# Altium project OZ440-SE140-CAR001.PrjPcb (part 1 of 2)
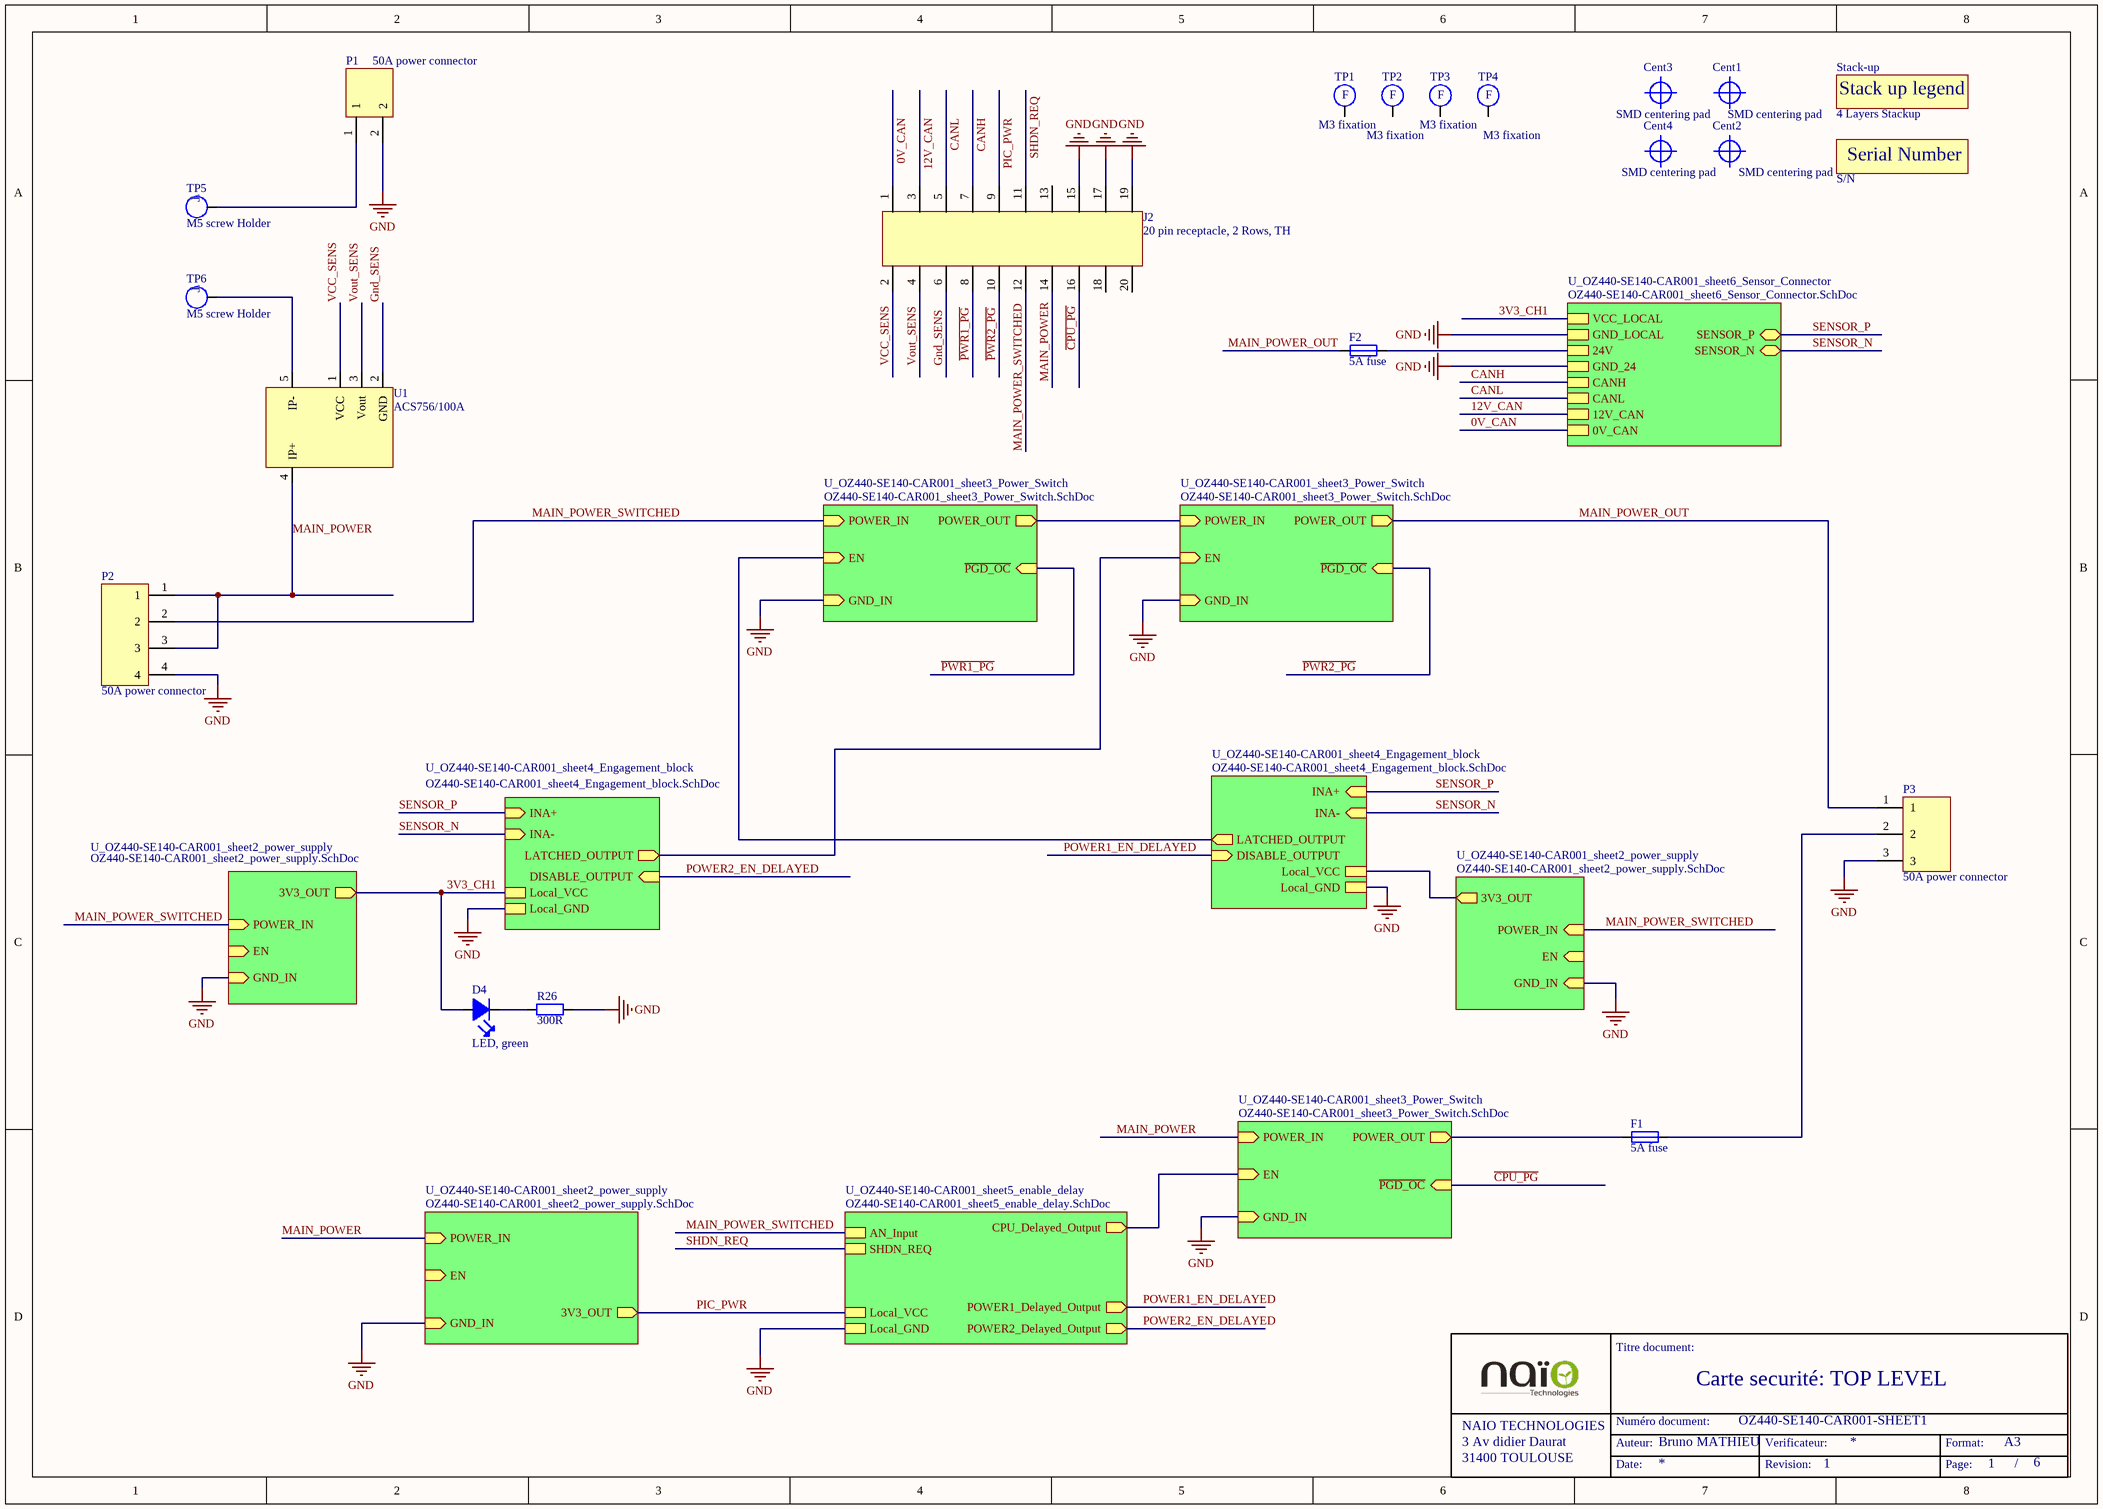
[diagram p0: OZ440-SE140-CAR001_sheet1.SchDoc]
AssyDocumentNumber: OZ440-SE140-ASS001; BoardName: Carte securité barierres sensibles; BoardPartNumber: OZ440-SE140-CAR001; BoardRevision: 2V; DesignEngineer: Bruno MATHIEU; ProjectTitle: OZ440
6 sheets, 153 parts. Net scope: strictly hierarchical (ports join the sheet entries above them; power ports are local).
Board file: OZ440-SE140-CAR001.PcbDoc
Sheets:
  OZ440-SE140-CAR001_sheet1.SchDoc
    U_OZ440-SE140-CAR001_sheet2_power_supply = OZ440-SE140-CAR001_sheet2_power_supply.SchDoc
    U_OZ440-SE140-CAR001_sheet2_power_supply = OZ440-SE140-CAR001_sheet2_power_supply.SchDoc
    U_OZ440-SE140-CAR001_sheet3_Power_Switch = OZ440-SE140-CAR001_sheet3_Power_Switch.SchDoc
    U_OZ440-SE140-CAR001_sheet3_Power_Switch = OZ440-SE140-CAR001_sheet3_Power_Switch.SchDoc
    U_OZ440-SE140-CAR001_sheet4_Engagement_block = OZ440-SE140-CAR001_sheet4_Engagement_block.SchDoc
    U_OZ440-SE140-CAR001_sheet4_Engagement_block = OZ440-SE140-CAR001_sheet4_Engagement_block.SchDoc
    U_OZ440-SE140-CAR001_sheet2_power_supply = OZ440-SE140-CAR001_sheet2_power_supply.SchDoc
    U_OZ440-SE140-CAR001_sheet5_enable_delay = OZ440-SE140-CAR001_sheet5_enable_delay.SchDoc
    U_OZ440-SE140-CAR001_sheet3_Power_Switch = OZ440-SE140-CAR001_sheet3_Power_Switch.SchDoc
    U_OZ440-SE140-CAR001_sheet6_Sensor_Connector = OZ440-SE140-CAR001_sheet6_Sensor_Connector.SchDoc

## Sheet OZ440-SE140-CAR001_sheet1.SchDoc: Carte securité: TOP LEVEL
size A3; Author: Bruno MATHIEU; CompanyName: NAIO TECHNOLOGIES; DrawnBy: Bruno MATHIEU; Engineer: Bruno MATHIEU; DocumentNumber: OZ440-SE140-CAR001-SHEET1; Revision: 1; SheetNumber: 1; SheetTotal: 6; CurrentDate: 27/11/14; DocumentName: Carte securité: TOP LEVEL

### Parts
(Parts that share a designator on the sheet are numbered #1, #2 ... from top to bottom, then left to right.)
Cent1  MEC-STD-CENTER  [MEC-STD-CENTER]  (value not drawn)  (no BOM)
Cent2  MEC-STD-CENTER  [MEC-STD-CENTER]  (value not drawn)  (no BOM)
Cent3  MEC-STD-CENTER  [MEC-STD-CENTER]  (value not drawn)  (no BOM)
Cent4  MEC-STD-CENTER  [MEC-STD-CENTER]  (value not drawn)  (no BOM)
D4  Displayed reference: LED, green  [LED_3MM]  (hidden comment: LED)  (no BOM)
F1#1  Displayed reference: 5A fuse  [F-SPE-154Series_littlefuse]  (hidden comment: FUSE-SMD)
F2  Displayed reference: 5A fuse  [F-SPE-154Series_littlefuse]  (hidden comment: FUSE-SMD)
J2  Displayed reference: 20 pin receptacle, 2 Rows, TH  [CONN-SPE_ESQ-110-12-G-D]  (hidden comment: CONN-STD-20P_2ROW)
P1  Displayed reference: 50A power connector  [CONN-SPE-428192213_MOLEX]  (hidden comment: CONN-STD-2P_puissance)
P2  Displayed reference: 50A power connector  [CONN-SPE-428194213_MOLEX]  (hidden comment: CONN-STD-4P_puissance)
P3  Displayed reference: 50A power connector  [CONN-SPE-428193213_MOLEX]  (hidden comment: CONN-STD-3P_puissance)
R26  Displayed reference: 300R  [R0805-STD]  (hidden comment: RES-SMD)
SN  Displayed reference: S/N  [SERIAL_NUMBER-STD]  (hidden comment: SERIAL-NUMBER)  (no BOM)
Stack-up  Displayed reference: 4 Layers Stackup  [STACKUP-SPE-4LAYERS]  (hidden comment: STACKUP)  (no BOM)
TP1  Displayed reference: M3 fixation  [MEC-STD-FIX_M3]  (hidden comment: FIX-STD-PCB_FIXATION)  (no BOM)
TP2  Displayed reference: M3 fixation  [MEC-STD-FIX_M3]  (hidden comment: FIX-STD-PCB_FIXATION)  (no BOM)
TP3  Displayed reference: M3 fixation  [MEC-STD-FIX_M3]  (hidden comment: FIX-STD-PCB_FIXATION)  (no BOM)
TP4  Displayed reference: M3 fixation  [MEC-STD-FIX_M3]  (hidden comment: FIX-STD-PCB_FIXATION)  (no BOM)
TP5  Displayed reference: M5 screw Holder  [MEC-SPE-WURTHZ_7460408]  (hidden comment: TP-STD-TEST_POINT)
TP6  Displayed reference: M5 screw Holder  [MEC-SPE-WURTHZ_7460408]  (hidden comment: TP-STD-TEST_POINT)
U1  Displayed reference: ACS756/100A  [CA_PFF-SPE-ACS756]  (hidden comment: ACS756-CA_PFF)

### Sub-sheets
U_OZ440-SE140-CAR001_sheet2_power_supply = OZ440-SE140-CAR001_sheet2_power_supply.SchDoc: EN (in), POWER_IN (in), GND_IN (in), 3V3_OUT (out)
U_OZ440-SE140-CAR001_sheet2_power_supply = OZ440-SE140-CAR001_sheet2_power_supply.SchDoc: EN (in), POWER_IN (in), GND_IN (in), 3V3_OUT (out)
U_OZ440-SE140-CAR001_sheet2_power_supply = OZ440-SE140-CAR001_sheet2_power_supply.SchDoc: EN (in), POWER_IN (in), GND_IN (in), 3V3_OUT (out)
U_OZ440-SE140-CAR001_sheet3_Power_Switch = OZ440-SE140-CAR001_sheet3_Power_Switch.SchDoc: POWER_IN (in), GND_IN (in), EN (in), POWER_OUT (out), ~{PGD_OC} (in)
U_OZ440-SE140-CAR001_sheet3_Power_Switch = OZ440-SE140-CAR001_sheet3_Power_Switch.SchDoc: POWER_IN (in), GND_IN (in), EN (in), POWER_OUT (out), ~{PGD_OC} (in)
U_OZ440-SE140-CAR001_sheet3_Power_Switch = OZ440-SE140-CAR001_sheet3_Power_Switch.SchDoc: POWER_IN (in), GND_IN (in), EN (in), POWER_OUT (out), ~{PGD_OC} (in)
U_OZ440-SE140-CAR001_sheet4_Engagement_block = OZ440-SE140-CAR001_sheet4_Engagement_block.SchDoc: LATCHED_OUTPUT (out), Local_VCC, Local_GND, INA+ (in), INA- (in), DISABLE_OUTPUT (in)
U_OZ440-SE140-CAR001_sheet4_Engagement_block = OZ440-SE140-CAR001_sheet4_Engagement_block.SchDoc: LATCHED_OUTPUT (out), Local_VCC, Local_GND, INA+ (in), INA- (in), DISABLE_OUTPUT (in)
U_OZ440-SE140-CAR001_sheet5_enable_delay = OZ440-SE140-CAR001_sheet5_enable_delay.SchDoc: Local_VCC, Local_GND, AN_Input, CPU_Delayed_Output (out), SHDN_REQ, POWER1_Delayed_Output (out), POWER2_Delayed_Output (out)
U_OZ440-SE140-CAR001_sheet6_Sensor_Connector = OZ440-SE140-CAR001_sheet6_Sensor_Connector.SchDoc: VCC_LOCAL, GND_LOCAL, 24V, GND_24, CANH, CANL, 12V_CAN, 0V_CAN, SENSOR_P, SENSOR_N

### Nets
3V3_CH1: D4.1(A) ; sheet U_OZ440-SE140-CAR001_sheet4_Engagement_block/Local_VCC, sheet U_OZ440-SE140-CAR001_sheet2_power_supply/3V3_OUT, sheet U_OZ440-SE140-CAR001_sheet6_Sensor_Connector/VCC_LOCAL
GND: J2.15 J2.17 J2.19 P1.2 P2.4 P3.3 R26.1 ; sheet U_OZ440-SE140-CAR001_sheet2_power_supply/GND_IN, sheet U_OZ440-SE140-CAR001_sheet2_power_supply/GND_IN, sheet U_OZ440-SE140-CAR001_sheet3_Power_Switch/GND_IN, sheet U_OZ440-SE140-CAR001_sheet3_Power_Switch/GND_IN, sheet U_OZ440-SE140-CAR001_sheet4_Engagement_block/Local_GND, sheet U_OZ440-SE140-CAR001_sheet4_Engagement_block/Local_GND, sheet U_OZ440-SE140-CAR001_sheet2_power_supply/GND_IN, sheet U_OZ440-SE140-CAR001_sheet5_enable_delay/Local_GND, sheet U_OZ440-SE140-CAR001_sheet3_Power_Switch/GND_IN, sheet U_OZ440-SE140-CAR001_sheet6_Sensor_Connector/GND_LOCAL, sheet U_OZ440-SE140-CAR001_sheet6_Sensor_Connector/GND_24
PIC_PWR: J2.9 ; sheet U_OZ440-SE140-CAR001_sheet2_power_supply/3V3_OUT, sheet U_OZ440-SE140-CAR001_sheet5_enable_delay/Local_VCC
VCC: sheet U_OZ440-SE140-CAR001_sheet2_power_supply/3V3_OUT, sheet U_OZ440-SE140-CAR001_sheet4_Engagement_block/Local_VCC
0V_CAN: J2.1 ; sheet U_OZ440-SE140-CAR001_sheet6_Sensor_Connector/0V_CAN
12V_CAN: J2.3 ; sheet U_OZ440-SE140-CAR001_sheet6_Sensor_Connector/12V_CAN
~{CPU_PG}: J2.16 ; sheet U_OZ440-SE140-CAR001_sheet3_Power_Switch/~{PGD_OC}
~{PWR1_PG}: J2.8 ; sheet U_OZ440-SE140-CAR001_sheet3_Power_Switch/~{PGD_OC}
~{PWR2_PG}: J2.10 ; sheet U_OZ440-SE140-CAR001_sheet3_Power_Switch/~{PGD_OC}
CANH: J2.7 ; sheet U_OZ440-SE140-CAR001_sheet6_Sensor_Connector/CANH
CANL: J2.5 ; sheet U_OZ440-SE140-CAR001_sheet6_Sensor_Connector/CANL
Gnd_SENS: J2.6 U1.2(GND)
MAIN_POWER: J2.14 P2.1 P2.3 U1.4(IP+) ; sheet U_OZ440-SE140-CAR001_sheet2_power_supply/POWER_IN, sheet U_OZ440-SE140-CAR001_sheet3_Power_Switch/POWER_IN
MAIN_POWER_OUT: F2.1 P3.1 ; sheet U_OZ440-SE140-CAR001_sheet3_Power_Switch/POWER_OUT
MAIN_POWER_SWITCHED: J2.12 P2.2 ; sheet U_OZ440-SE140-CAR001_sheet2_power_supply/POWER_IN, sheet U_OZ440-SE140-CAR001_sheet3_Power_Switch/POWER_IN, sheet U_OZ440-SE140-CAR001_sheet2_power_supply/POWER_IN, sheet U_OZ440-SE140-CAR001_sheet5_enable_delay/AN_Input
POWER1_EN_DELAYED: sheet U_OZ440-SE140-CAR001_sheet4_Engagement_block/DISABLE_OUTPUT, sheet U_OZ440-SE140-CAR001_sheet5_enable_delay/POWER1_Delayed_Output
POWER2_EN_DELAYED: sheet U_OZ440-SE140-CAR001_sheet4_Engagement_block/DISABLE_OUTPUT, sheet U_OZ440-SE140-CAR001_sheet5_enable_delay/POWER2_Delayed_Output
SENSOR_N: sheet U_OZ440-SE140-CAR001_sheet4_Engagement_block/INA-, sheet U_OZ440-SE140-CAR001_sheet4_Engagement_block/INA-, sheet U_OZ440-SE140-CAR001_sheet6_Sensor_Connector/SENSOR_N
SENSOR_P: sheet U_OZ440-SE140-CAR001_sheet4_Engagement_block/INA+, sheet U_OZ440-SE140-CAR001_sheet4_Engagement_block/INA+, sheet U_OZ440-SE140-CAR001_sheet6_Sensor_Connector/SENSOR_P
SHDN_REQ: J2.11 ; sheet U_OZ440-SE140-CAR001_sheet5_enable_delay/SHDN_REQ  [project net ~{Rese}t_PIC]
VCC_SENS: J2.2 U1.1(VCC)
Vout_SENS: J2.4 U1.3(Vout)
NetC7_U_OZ440-SE140-CAR001_sheet3_Power_Switch#2_2: sheet U_OZ440-SE140-CAR001_sheet3_Power_Switch/POWER_OUT, sheet U_OZ440-SE140-CAR001_sheet3_Power_Switch/POWER_IN
NetC8_U_OZ440-SE140-CAR001_sheet3_Power_Switch#3_1: F1#1.1 ; sheet U_OZ440-SE140-CAR001_sheet3_Power_Switch/POWER_OUT
NetD4_2: D4.2 R26.2
NetF1#1_2: F1#1.2 P3.2
NetF2_2: F2.2 ; sheet U_OZ440-SE140-CAR001_sheet6_Sensor_Connector/24V
NetP1_1: P1.1 TP5.1(T)
NetQ2_U_OZ440-SE140-CAR001_sheet4_Engagement_block#1_3: sheet U_OZ440-SE140-CAR001_sheet3_Power_Switch/EN, sheet U_OZ440-SE140-CAR001_sheet4_Engagement_block/LATCHED_OUTPUT
NetQ2_U_OZ440-SE140-CAR001_sheet4_Engagement_block#2_3: sheet U_OZ440-SE140-CAR001_sheet3_Power_Switch/EN, sheet U_OZ440-SE140-CAR001_sheet4_Engagement_block/LATCHED_OUTPUT
NetTP6_1: TP6.1(T) U1.5(IP-)
NetU3_U_OZ440-SE140-CAR001_sheet3_Power_Switch#3_5: sheet U_OZ440-SE140-CAR001_sheet5_enable_delay/CPU_Delayed_Output, sheet U_OZ440-SE140-CAR001_sheet3_Power_Switch/EN

Not connected (* = marked no-connect by the designer): J2 13 18 20; TP1 1(T); TP2 1(T); TP3 1(T); TP4 1(T)

### Notes on the sheet
- Titre document:
- NAIO TECHNOLOGIES
- 3 Av didier Daurat
- 31400 TOULOUSE
- Auteur:
- Numéro document:
- Verificateur:
- Format:
- A3
- Date:
- Revision:
- Page:
- /
- (in symbol 4 Layers Stackup) Stack up legend
- (in symbol M3 Fixation) F

### Library data of the parts
Cent1-Cent4 = SMD centering pad: Validated: False; Reference: SMD centering pad; Displayed reference: SMD centering pad
D4 = L-934GD: LED 3mm green TH; Manufacturer: Kingbright; Max Current: 20mA; Validated: False; Reference: L-934GD; Footprint description: TH 2.54mm pitch; Pin Count: 2; Rev: V.8; helpURL: http://www.farnell.com/datasheets/67148.pdf; Supplier 1: Farnell; Supplier Part Number 1: 1142502
F1#1 F2 = 0154005.DRT: 5A T fuse with SMD holder; Manufacturer: LITTLEFUSE; Max Voltage: 125V; Validated: False; Reference: 0154005.DRT; Max Current: 5A; Pin Count: 2; Rev: 3/10/14; helpURL: http://www.farnell.com/datasheets/1840330.pdf; Supplier 1: Farnell; Supplier Part Number 1: 2452874; Supplier 2: Mouser; Supplier Part Number 2: 576-0154005.DRTL
J2 = ESQ-110-12-G-D: 20 pin receptacle, 2.54mm, TH; Manufacturer: SAMTEC; Validated: False; Reference: ESQ-110-12-G-D; Footprint description: 20 pin receptacle, TH; Pin Count: 20; helpURL: https://www.samtec.com/technical-specifications/Default.aspx?SeriesMaster=ESQ; Supplier 1: Farnell; Supplier Part Number 1: 1769167
P1 = 42819-2213: 2 pin power connector, ST; Manufacturer: Molex; Max Voltage: 600V; Max Current: 50A; Validated: False; Reference: 42819-2213; Footprint description: Thu hole 10mm pitch; Pin Count: 2; Rev: E6; helpURL: http://www.molex.com/pdm_docs/sd/428192213_sd.pdf; Supplier 1: Newark; Supplier Part Number 1: 61H8951; Supplier 2: Mouser; Supplier Part Number 2: 538-42819-2213
P2 = 42819-4213: 4 pin power connector; Manufacturer: Molex; Max Voltage: 600V; Max Current: 50A; Validated: False; Reference: 42819-4213; Footprint description: Thu hole 10mm pitch; Pin Count: 4; Rev: E6; helpURL: http://www.molex.com/pdm_docs/sd/428194213_sd.pdf; Supplier 1: Mouser; Supplier Part Number 1: 538-42819-4213; Supplier 2: Newark; Supplier Part Number 2: 92M0969
P3 = 42819-3213: 3 pin power connector, ST; Manufacturer: Molex; Max Voltage: 600V; Max Current: 50A; Validated: False; Reference: 42819-3213; Footprint description: Thu hole 10mm pitch; Pin Count: 3; Rev: E6; helpURL: http://www.molex.com/pdm_docs/sd/428193213_sd.pdf; Supplier 1: Mouser; Supplier Part Number 1: 538-42819-3213; Supplier 2: Farnell; Supplier Part Number 2: 2334074
R26 = CRCW0805300RFKxx: 300 ohm 0805 SMD resistor; Manufacturer: Vishay; Value: 300; Tolerance: 1%; Rated Power: 0.125W; Validated: No; Reference: CRCW0805300RFKxx; Footprint description: standard 0805 SMD; Pin Count: 2; helpURL: http://www.vishay.com/docs/20035/dcrcwe3.pdf; Supplier 1: Mouser; Supplier Part Number 1: 71-CRCW0805300RFKEA; Supplier 2: Farnell; Supplier Part Number 2: 1152346
SN = Serial Number: serial number copper identification; Validated: False; Reference: Serial Number
Stack-up = 4 Layers Stackup: 4 Layers Stackup identification; Validated: False; Reference: 4 Layers Stackup
TP1-TP4 = M3 Fixation: M3 Hole for Board fixation; Validated: False; Reference: M3 Fixation
TP5 TP6 = 7460408: Bush with threaded hole M5; Manufacturer: WURTHZ; Max Current: 160A; Validated: False; Reference: 7460408; Material: CuZn39Pb3; Footprint description: Pressfit Bush with threaded hole M5; Pin Count: 1; helpURL: http://katalog.we-online.de/em/datasheet/7460408.pdf; Supplier 1: Farnell; Supplier Part Number 1: 1821279; Supplier 2: Mouser; Supplier Part Number 2: 710-7460408
U1 = ACS756SCA-100B-PFF-T: +/- 100A Linear Current Sensor IC; Manufacturer: Allegro; Max Voltage: 5; Frequency band: 100kHz; Gain: 40mV/A; Validated: False; Reference: ACS756SCA-100B-PFF-T; Max Current: 100A; Footprint description: CA_PFF specific; Pin Count: 5; Rev: 6; helpURL: http://www.allegromicro.com/~/media/Files/Datasheets/ACS756-Datasheet.ashx; Supplier 1: Farnell; Supplier Part Number 1: 2112638; Supplier 2: Digi-Key; Supplier Part Number 2: 620-1238-ND

## Sheet OZ440-SE140-CAR001_sheet2_power_supply.SchDoc
size A3
Used 3 times, as channels U_OZ440-SE140-CAR001_sheet2_power_supply, U_OZ440-SE140-CAR001_sheet2_power_supply, U_OZ440-SE140-CAR001_sheet2_power_supply. Parts and nets are listed once, with the designators drawn on the sheet.
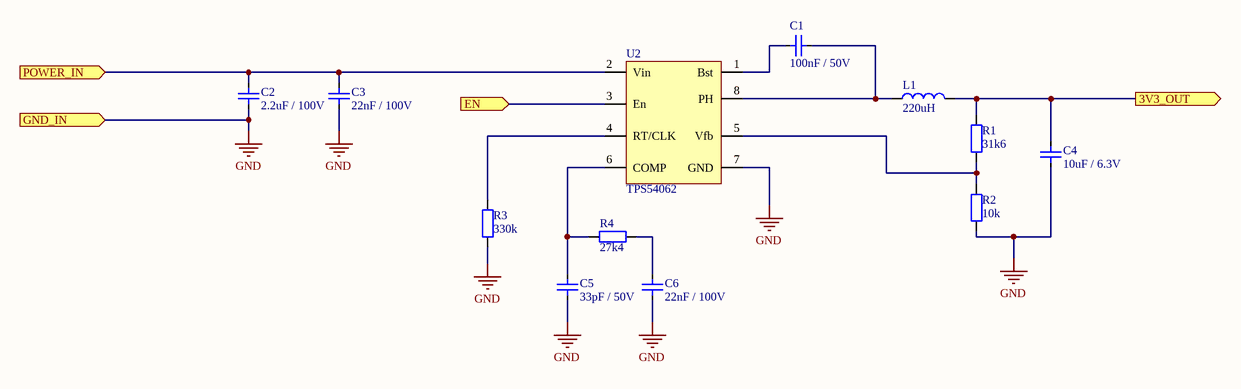
[diagram p1: OZ440-SE140-CAR001_sheet2_power_supply.SchDoc]

### Parts
C1  Displayed reference: 100nF / 50V  [C0805-STD]  (hidden comment: CAP-SMD)
C2  Displayed reference: 2.2uF / 100V  [C1206-STD]  (hidden comment: CAP-SMD)
C3  Displayed reference: 22nF / 100V  [C0805-STD]  (hidden comment: CAP-SMD)
C4  Displayed reference: 10uF / 6.3V  [C0805-STD]  (hidden comment: CAP-SMD)
C5  Displayed reference: 33pF / 50V  [C0805-STD]  (hidden comment: CAP-SMD)
C6  Displayed reference: 22nF / 100V  [C0805-STD]  (hidden comment: CAP-SMD)
L1  Displayed reference: 220uH  [L-SPE-4600Series_Murata]  (hidden comment: IND-SMD)
R1  Displayed reference: 31k6  [R0805-STD]  (hidden comment: RES-SMD)
R2  Displayed reference: 10k  [R0805-STD]  (hidden comment: RES-SMD)
R3  Displayed reference: 330k  [R0805-STD]  (hidden comment: RES-SMD)
R4  Displayed reference: 27k4  [R0805-STD]  (hidden comment: RES-SMD)
U2  Displayed reference: TPS54062  [MSOP08-SPE-TPS54062]  (hidden comment: TPS54062-MSOP8)

### Ports
3V3_OUT (out), EN (in), GND_IN (in), POWER_IN (in)

### Nets
GND: C2.1 C3.1 C4.1 C5.1 C6.1 R2.1 R3.1 U2.7(GND) ; port GND_IN
3V3_OUT: C4.2 L1.2 R1.2 ; port 3V3_OUT
EN: U2.3(En) ; port EN
POWER_IN: C2.2 C3.2 U2.2(Vin) ; port POWER_IN
NetC1_1: C1.1 U2.1(Bst)
NetC1_2: C1.2 L1.1 U2.8(PH)
NetC5_2: C5.2 R4.1 U2.6(COMP)
NetC6_2: C6.2 R4.2
NetR1_1: R1.1 R2.2 U2.5(Vfb)
NetR3_2: R3.2 U2.4(RT/CLK)

### Channels
U_OZ440-SE140-CAR001_sheet2_power_supply: designators end in _U_OZ440-SE140-CAR001_sheet2_power_supply#1; ports 3V3_OUT=PIC_PWR EN=NetU2_U_OZ440-SE140-CAR001_sheet2_power_supply#1_3 GND_IN=GND POWER_IN=MAIN_POWER
U_OZ440-SE140-CAR001_sheet2_power_supply: designators end in _U_OZ440-SE140-CAR001_sheet2_power_supply#2; ports 3V3_OUT=VCC EN=NetU2_U_OZ440-SE140-CAR001_sheet2_power_supply#2_3 GND_IN=GND POWER_IN=MAIN_POWER_SWITCHED
U_OZ440-SE140-CAR001_sheet2_power_supply: designators end in _U_OZ440-SE140-CAR001_sheet2_power_supply#3; ports 3V3_OUT=3V3_CH1 EN=NetU2_U_OZ440-SE140-CAR001_sheet2_power_supply#3_3 GND_IN=GND POWER_IN=MAIN_POWER_SWITCHED

### Notes on the sheet
- Titre document:
- NAIO TECHNOLOGIES
- 3 Av didier Daurat
- 31400 TOULOUSE
- Auteur:
- Numéro document:
- Verificateur:
- Format:
- A3
- Date:
- Revision:
- Page:
- /

### Library data of the parts
C1 = VJ0805Y104KXAxx: 0805 100nF / 50V  X7R ceramic capacitor; Manufacturer: vishay; Max Voltage: 50; Tolerance: +/- 10%; Validated: N; Reference: VJ0805Y104KXAxx; Value: 100nF; Material: X7R; Footprint description: standard Capacitor 0805; Pin Count: 2; helpURL: http://www.vishay.com/docs/45200/highrels.pdf; Supplier 1: Farnell; Supplier Part Number 1: 1612208; Supplier 2: Digi-Key; Supplier Part Number 2: 720-1266-6-ND
C2 = C3216X7S2A225Kxxx: 1206 2.2uF / 100V X7S ceramic capacitor; Manufacturer: TDK; Max Voltage: 100; Tolerance: +/- 10%; Validated: N; Reference: C3216X7S2A225Kxxx; Value: 2.2uF; Material: X7S; Footprint description: standard Capacitor 1206; Pin Count: 2; helpURL: http://www.mouser.com/ds/2/400/C3216X7S2A225K160AB-265429.pdf; Supplier 1: Mouser; Supplier Part Number 1: 810-C3216X7S2A225K; Supplier 2: Farnell; Supplier Part Number 2: 2112717
C3 C6 = VJ0805Y223KXBxx: 0805 22nF / 100V X7R ceramic capacitor; Manufacturer: vishay; Value: 100nF; Max Voltage: 100; Tolerance: +/- 10%; Validated: N; Reference: VJ0805Y223KXBxx; Material: X7R; Footprint description: standard Capacitor 0805; Pin Count: 2; helpURL: http://www.vishay.com/docs/45200/highrels.pdf; Supplier 1: Mouser; Supplier Part Number 1: 77-VJ0805Y223KXBBC31; Supplier 2: Farnell; Supplier Part Number 2: 2407374
C4 = C0805C106K9PACxx: 0805 10uF / 6.3V X5R ceramic capacitor; Manufacturer: Kemet; Max Voltage: 6.3; Tolerance: +/- 10%; Validated: N; Reference: C0805C106K9PACxx; Value: 10uF; Material: X5R; Footprint description: standard Capacitor 0805; Pin Count: 2; helpURL: http://www.farnell.com/datasheets/40863.pdf; Supplier 1: Farnell; Supplier Part Number 1: 1643357; Supplier 2: Digi-Key; Supplier Part Number 2: 399-3138-1-ND
C5 = C0805C330J5GACxx: 0805 33pF / 50V COG ceramic capacitor; Manufacturer: Kemet; Max Voltage: 50; Tolerance: +/- 10%; Validated: False; Reference: C0805C330J5GACxx; Value: 33pF; Material: COG; Footprint description: standard Capacitor 0805; Pin Count: 2; helpURL: http://www.farnell.com/datasheets/40863.pdf; Supplier 1: Mouser; Supplier Part Number 1: 80-C0805C330J5GACTM; Supplier 2: Farnell; Supplier Part Number 2: 1414685
L1 = 46224C: 220uH SMD inductor; Manufacturer: MURATA; Reference: 46224C; Max Current: 0.57A; Validated: False; Value: 220uH; Footprint description: SMD 2 pin; Pin Count: 2; Rev: B03; helpURL: http://www.farnell.com/datasheets/1482257.pdf; Supplier 1: Mouser; Supplier Part Number 1: 580-46224C; Supplier 2: Farnell; Supplier Part Number 2: 2062837
R1 = CRCW080531K6FKxx: 31k6 Ohm 0805 SMD resistor; Manufacturer: Vishay; Value: 31 600; Tolerance: 1%; Rated Power: 0.125W; Validated: False; Reference: CRCW080531K6FKxx; Footprint description: standard 0805 SMD; Pin Count: 2; helpURL: http://www.vishay.com/docs/20035/dcrcwe3.pdf; Supplier 1: Mouser; Supplier Part Number 1: 71-CRCW0805-31.6K-E3; Supplier 2: Farnell; Supplier Part Number 2: 1469916
R2 = CRCW080510K0FKxx: 10k Ohm 0805 SMD resistor; Manufacturer: Vishay; Value: 10 000; Tolerance: 1 %; Rated Power: 0,125 W; Validated: No; Reference: CRCW080510K0FKxx; Footprint description: standard 0805 SMD; Pin Count: 2; helpURL: http://www.vishay.com/docs/20035/dcrcwe3.pdf; Supplier 1: Farnell; Supplier Part Number 1: 1469856; Supplier 2: Mouser; Supplier Part Number 2: 71-CRCW0805-10K-E3
R3 = CRCW0805330KFKxx: 330k Ohm 0805 SMD resistor; Manufacturer: Vishay; Value: 330 000; Tolerance: 1%; Rated Power: 0.125W; Validated: False; Reference: CRCW0805330KFKxx; Footprint description: standard 0805 SMD; Pin Count: 2; helpURL: http://www.vishay.com/docs/20035/dcrcwe3.pdf; Supplier 1: Farnell; Supplier Part Number 1: 2123444; Supplier 2: Mouser; Supplier Part Number 2: 71-CRCW0805330KFKEA
R4 = CRCW080527K4FKxx: 27k4 Ohm 0805 SMD resistor; Manufacturer: Vishay; Value: 27 400; Tolerance: 1%; Rated Power: 0.125W; Validated: False; Reference: CRCW080527K4FKxx; Footprint description: standard 0805 SMD; Pin Count: 2; helpURL: http://www.vishay.com/docs/20035/dcrcwe3.pdf; Supplier 1: Mouser; Supplier Part Number 1: 71-CRCW0805-27.4K-E3; Supplier 2: Farnell; Supplier Part Number 2: 1652971RL
U2 = TPS54062DGK: 4.7V to 60V Input, 50mA Synchronous Step-Down Converter; Manufacturer: TI; Max Current: 0.05A; Validated: False; Reference: TPS54062DGK; Max Voltage: 60V; Footprint description: MSOP-8; Pin Count: 8; Rev: 05/2011; helpURL: http://www.ti.com/lit/ds/symlink/tps54062.pdf; Supplier 1: Farnell; Supplier Part Number 1: 2045284; Supplier 2: Mouser; Supplier Part Number 2: 595-TPS54062DGKR

## Sheet OZ440-SE140-CAR001_sheet3_Power_Switch.SchDoc
size A3
Used 3 times, as channels U_OZ440-SE140-CAR001_sheet3_Power_Switch, U_OZ440-SE140-CAR001_sheet3_Power_Switch, U_OZ440-SE140-CAR001_sheet3_Power_Switch. Parts and nets are listed once, with the designators drawn on the sheet.
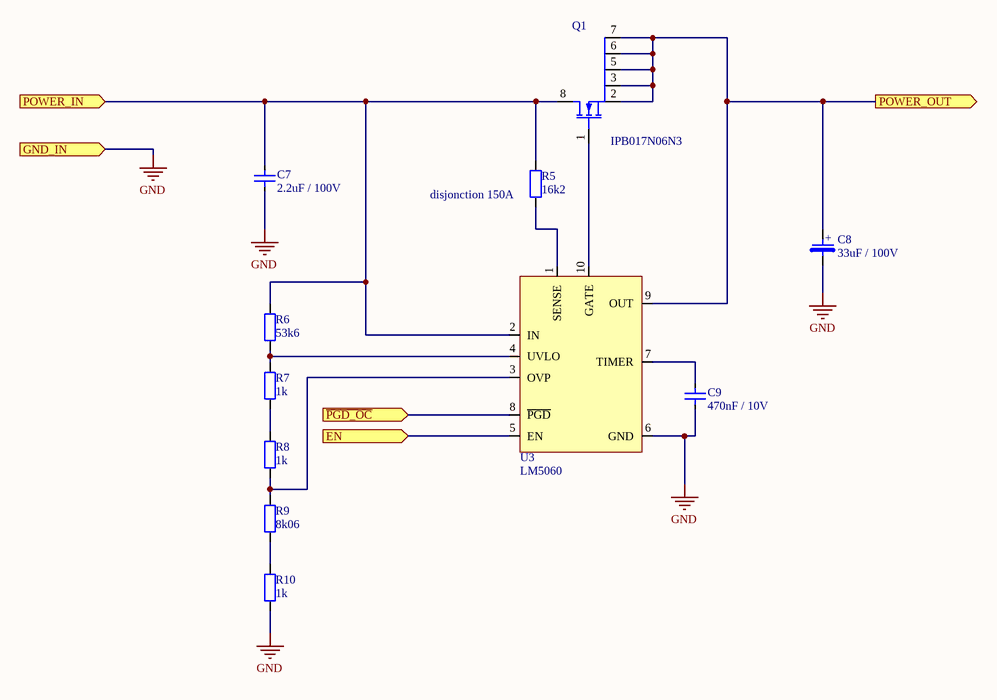
[diagram p2: OZ440-SE140-CAR001_sheet3_Power_Switch.SchDoc]

### Parts
C7  Displayed reference: 2.2uF / 100V  [C1206-STD]  (hidden comment: CAP-SMD)
C8  Displayed reference: 33uF / 100V  [CAP-ELECTRO-SMD_SIZE_G]  (hidden comment: CAP-POL-SMD)
C9  Displayed reference: 470nF / 10V  [C0603-STD]  (hidden comment: CAP-SMD)
Q1  Displayed reference: IPB017N06N3  [TO263-3-SPE-IPB039N10N3]  (hidden comment: IPB039N10N3-PGTO263_3)
R5  Displayed reference: 16k2  [R0805-STD]  (hidden comment: RES-SMD)
R6  Displayed reference: 53k6  [R0805-STD]  (hidden comment: RES-SMD)
R7  Displayed reference: 1k  [R0805-STD]  (hidden comment: RES-SMD)
R8  Displayed reference: 1k  [R0805-STD]  (hidden comment: RES-SMD)
R9  Displayed reference: 8k06  [R0805-STD]  (hidden comment: RES-SMD)
R10  Displayed reference: 1k  [R0805-STD]  (hidden comment: RES-SMD)
U3  Displayed reference: LM5060  [VSSOP10-SPE-LM5060]  (hidden comment: LM5060-VSSOP10)

### Ports
EN (in), GND_IN (in), POWER_IN (in), POWER_OUT (out), ~{PGD_OC} (in)

### Nets
GND: C7.1 C8.2 C9.1 R10.1 U3.6(GND) ; port GND_IN
~{PGD_OC}: U3.8(~{PGD}) ; port ~{PGD_OC}
EN: U3.5(EN) ; port EN
POWER_IN: C7.2 Q1.8(S) R5.2 R6.2 U3.2(IN) ; port POWER_IN
POWER_OUT: C8.1 Q1.2(D) Q1.3(D) Q1.5(D) Q1.6(D) Q1.7(D) U3.9(OUT) ; port POWER_OUT
NetC9_2: C9.2 U3.7(TIMER)
NetQ1_1: Q1.1(G) U3.10(GATE)
NetR5_1: R5.1 U3.1(SENSE)
NetR6_1: R6.1 R7.2 U3.4(UVLO)
NetR7_1: R7.1 R8.2
NetR8_1: R8.1 R9.2 U3.3(OVP)
NetR9_1: R9.1 R10.2

### Channels
U_OZ440-SE140-CAR001_sheet3_Power_Switch: designators end in _U_OZ440-SE140-CAR001_sheet3_Power_Switch#1; ports EN=NetQ2_U_OZ440-SE140-CAR001_sheet4_Engagement_block#2_3 GND_IN=GND POWER_IN=MAIN_POWER_SWITCHED POWER_OUT=NetC7_U_OZ440-SE140-CAR001_sheet3_Power_Switch#2_2 ~{PGD_OC}=~{PWR1_PG}
U_OZ440-SE140-CAR001_sheet3_Power_Switch: designators end in _U_OZ440-SE140-CAR001_sheet3_Power_Switch#2; ports EN=NetQ2_U_OZ440-SE140-CAR001_sheet4_Engagement_block#1_3 GND_IN=GND POWER_IN=NetC7_U_OZ440-SE140-CAR001_sheet3_Power_Switch#2_2 POWER_OUT=MAIN_POWER_OUT ~{PGD_OC}=~{PWR2_PG}
U_OZ440-SE140-CAR001_sheet3_Power_Switch: designators end in _U_OZ440-SE140-CAR001_sheet3_Power_Switch#3; ports EN=NetU3_U_OZ440-SE140-CAR001_sheet3_Power_Switch#3_5 GND_IN=GND POWER_IN=MAIN_POWER POWER_OUT=NetC8_U_OZ440-SE140-CAR001_sheet3_Power_Switch#3_1 ~{PGD_OC}=~{CPU_PG}

### Notes on the sheet
- (near R5) disjonction 150A
- Titre document:
- NAIO TECHNOLOGIES
- 3 Av didier Daurat
- 31400 TOULOUSE
- Auteur:
- Numéro document:
- Verificateur:
- Format:
- A3
- Date:
- Revision:
- Page:
- /
- (in symbol EEE2AA330P) +

### Library data of the parts
C7 = C3216X7S2A225Kxxx: as C2 on sheet OZ440-SE140-CAR001_sheet2_power_supply; Reference: C3216X7S2A225Kxxx; Value: 2.2uF; Material: X7S; Footprint description: standard Capacitor 1206; Pin Count: 2; helpURL: http://www.mouser.com/ds/2/400/C3216X7S2A225K160AB-265429.pdf; Supplier 1: Mouser; Supplier Part Number 1: 810-C3216X7S2A225K; Supplier 2: Farnell; Supplier Part Number 2: 2112717
C8 = EEE2AA330P: 33uF / 100V Aluminium capacitor SMD; Manufacturer: Panasonic; Max Current: 0.05; Reference: EEE2AA330P; Value: 33uF; Max Voltage: 100V; Material: Aluminium; Footprint description: 10mmx10mm; Pin Count: 2; helpURL: http://industrial.panasonic.com/www-data/pdf/ABA0000/ABA0000CE2.pdf; Supplier 1: Farnell; Supplier Part Number 1: 1899628; Supplier 2: Mouser; Supplier Part Number 2: 667-EEE-2AA330P
C9 = 0603ZD474KAT2A: 0603 470nF / 10V X5R ceramic capacitor; Manufacturer: AVX; Max Voltage: 10; Tolerance: +/- 10%; Validated: N; Reference: 0603ZD474KAT2A; Value: 470nF; Material: X5R; Footprint description: standard Capacitor 0603; Pin Count: 2; helpURL: http://avx.com/docs/Catalogs/cx7r.pdf; Supplier 1: Farnell; Supplier Part Number 1: 1833805; Supplier 2: Mouser; Supplier Part Number 2: 581-0603ZD474KAT2A
Q1 = IPB017N06N3: 60V/180A N channel MOSFET in DPAK package; Manufacturer: INFINEON; Max Voltage: 60V; Max Current: 180A; Rated Power: 250W; Reference: IPB017N06N3; component type: NMOS; Footprint description: DPAK 8 pin; Pin Count: 8; Rev: 2.2; helpURL: https://www.infineon.com/dgdl/IPB017N06N3_Rev2.2.pdf?folderId=db3a30431441fb5d01148ca9f1be0e77&fileId=db3a30431ddc9372011e264a7ab746ea; Supplier 1: Farnell; Supplier Part Number 1: 1775519; Supplier 2: Mouser; Supplier Part Number 2: 726-IPB017N06N3G
R5 = CRCW080516K2FKxx: 16k2 Ohm 0805 SMD resistor; Manufacturer: Vishay; Value: 16200; Tolerance: 1%; Rated Power: 0.125W; Validated: No; Reference: CRCW080516K2FKxx; Footprint description: standard 0805 SMD; Pin Count: 2; helpURL: http://www.vishay.com/docs/20035/dcrcwe3.pdf; Supplier 1: Mouser; Supplier Part Number 1: 71-CRCW0805-16.2K-E3; Supplier 2: Farnell; Supplier Part Number 2: 1469878
R6 = CRCW080553K6FKxx: 53k6 Ohm 0805 SMD resistor; Manufacturer: Vishay; Value: 53600; Tolerance: 1%; Rated Power: 0.125W; Validated: No; Reference: CRCW080553K6FKxx; Footprint description: standard 0805 SMD; Pin Count: 2; helpURL: http://www.vishay.com/docs/20035/dcrcwe3.pdf; Supplier 1: Mouser; Supplier Part Number 1: 71-CRCW080553K6FKEA; Supplier 2: Farnell; Supplier Part Number 2: 1185098
R7 R8 R10 = CRCW08051K00FKxx: 1k Ohm 0805 SMD resistor; Manufacturer: Vishay; Value: 1 000; Tolerance: 1 %; Rated Power: 0,125 W; Validated: No; Reference: CRCW08051K00FKxx; Footprint description: standard 0805 SMD; Pin Count: 2; helpURL: http://www.vishay.com/docs/20035/dcrcwe3.pdf; Supplier 1: Farnell; Supplier Part Number 1: 1469847; Supplier 2: Mouser; Supplier Part Number 2: 71-CRCW0805-1.0K-E3
R9 = CRCW08058K06FKxx: 8k06 Ohm 0805 SMD resistor; Manufacturer: Vishay; Value: 8 060; Tolerance: 1%; Rated Power: 0.125W; Validated: No; Reference: CRCW08058K06FKxx; Footprint description: standard 0805 SMD; Pin Count: 2; helpURL: http://www.vishay.com/docs/20035/dcrcwe3.pdf; Supplier 1: Farnell; Supplier Part Number 1: 1653038; Supplier 2: Mouser; Supplier Part Number 2: 71-CRCW0805-8.06K-E3
U3 = LM5060MM: High-Side Protection Controller; Manufacturer: TI; Max Voltage: 65V; Validated: False; Reference: LM5060MM; Footprint description: VSSOP10; Pin Count: 10; Rev: 04/2013; helpURL: http://www.ti.com/lit/ds/symlink/lm5060.pdf; Supplier 1: Farnell; Supplier Part Number 1: 2383047; Supplier 2: Mouser; Supplier Part Number 2: 926-LM5060MM/NOPB

## Sheet OZ440-SE140-CAR001_sheet4_Engagement_block.SchDoc
size A3
Used 2 times, as channels U_OZ440-SE140-CAR001_sheet4_Engagement_block, U_OZ440-SE140-CAR001_sheet4_Engagement_block. Parts and nets are listed once, with the designators drawn on the sheet.
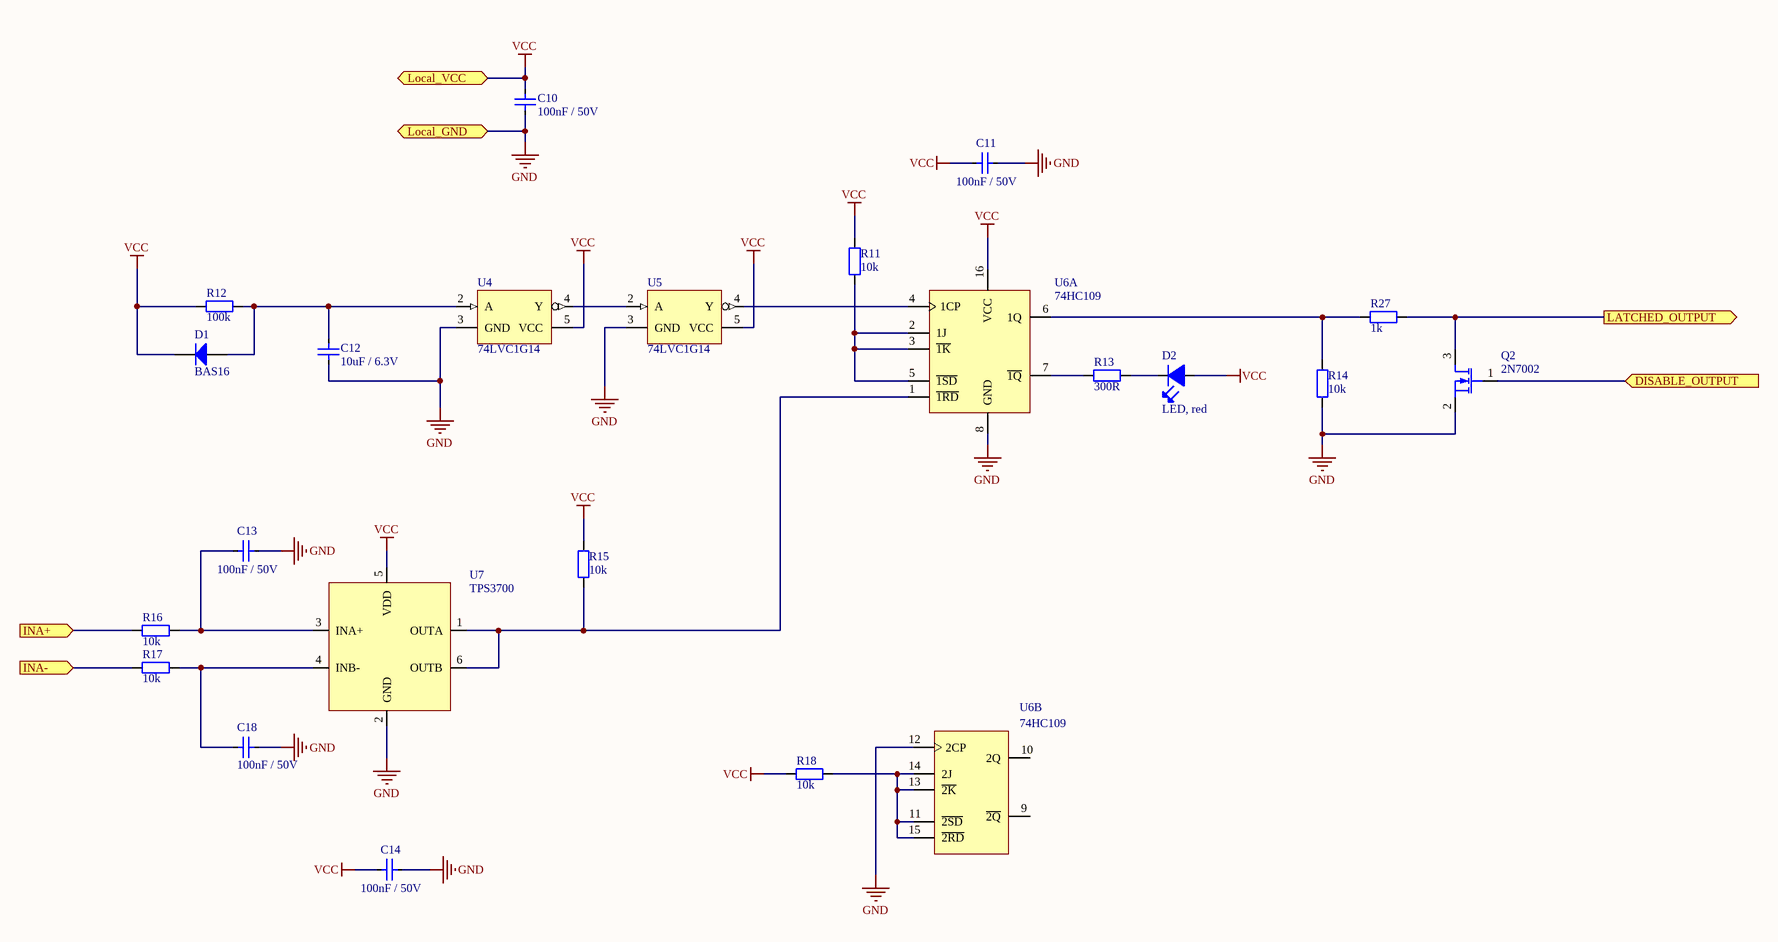
[diagram p3: OZ440-SE140-CAR001_sheet4_Engagement_block.SchDoc]

### Parts
C10  Displayed reference: 100nF / 50V  [C0805-STD]  (hidden comment: CAP-SMD)
C11  Displayed reference: 100nF / 50V  [C0805-STD]  (hidden comment: CAP-SMD)
C12  Displayed reference: 10uF / 6.3V  [C0805-STD]  (hidden comment: CAP-SMD)
C13  Displayed reference: 100nF / 50V  [C0805-STD]  (hidden comment: CAP-SMD)
C14  Displayed reference: 100nF / 50V  [C0805-STD]  (hidden comment: CAP-SMD)
C18  Displayed reference: 100nF / 50V  [C0805-STD]  (hidden comment: CAP-SMD)
D1  Displayed reference: BAS16  [SOT23-STD]  (hidden comment: BAS16-SOT23)
D2  Displayed reference: LED, red  [LED_3MM]  (hidden comment: LED)  (no BOM)
Q2  Displayed reference: 2N7002  [SOT23-SPE-2N7002]  (hidden comment: 2N7002-SMD3P)
R11  Displayed reference: 10k  [R0805-STD]  (hidden comment: RES-SMD)
R12  Displayed reference: 100k  [R0805-STD]  (hidden comment: RES-SMD)
R13  Displayed reference: 300R  [R0805-STD]  (hidden comment: RES-SMD)
R14  Displayed reference: 10k  [R0805-STD]  (hidden comment: RES-SMD)
R15  Displayed reference: 10k  [R0805-STD]  (hidden comment: RES-SMD)
R16  Displayed reference: 10k  [R0805-STD]  (hidden comment: RES-SMD)
R17  Displayed reference: 10k  [R0805-STD]  (hidden comment: RES-SMD)
R18  Displayed reference: 10k  [R0805-STD]  (hidden comment: RES-SMD)
R27  Displayed reference: 1k  [R0805-STD]  (hidden comment: RES-SMD)
U4  Displayed reference: 74LVC1G14  [SOT353-1_5pin-STD]  (hidden comment: 74xxx1G14GW-SOT353-1)
U5  Displayed reference: 74LVC1G14  [SOT353-1_5pin-STD]  (hidden comment: 74xxx1G14GW-SOT353-1)
U6  Displayed reference: 74HC109  [TSSOP16-SPE-74HC109]  (hidden comment: 74xxx109DB-TSSOP16)  (parts A,B of 2)
U7  Displayed reference: TPS3700  [SOT23_6-SPE-TPS3700]  (hidden comment: TPS3700-SOT23-6)

### Ports
DISABLE_OUTPUT (in), INA+ (in), INA- (in), LATCHED_OUTPUT (out), Local_GND, Local_VCC

### Nets
GND: C10.2 C11.2 C12.1 C13.2 C14.2 C18.2 Q2.2(S) R14.2 U4.3(GND) U5.3(GND) U6.8(GND) U6.12(2CP) U7.2(GND) ; port Local_GND
VCC: C10.1 C11.1 C14.1 D1.3(K) D2.1(A) R11.1 R12.1 R15.1 R18.1 U4.5(VCC) U5.5(VCC) U6.16(VCC) U7.5(VDD) ; port Local_VCC
DISABLE_OUTPUT: Q2.1(G) ; port DISABLE_OUTPUT
INA+: R16.1 ; port INA+
INA-: R17.1 ; port INA-
LATCHED_OUTPUT: Q2.3(D) R27.1 ; port LATCHED_OUTPUT
NetC12_2: C12.2 D1.1(A) R12.2 U4.2(A)
NetC13_1: C13.1 R16.2 U7.3(INA+)
NetC18_1: C18.1 R17.2 U7.4(INB-)
NetD2_2: D2.2 R13.2
NetR11_2: R11.2 U6.2(1J) U6.3(~{1K}) U6.5(~{1SD})
NetR13_1: R13.1 U6.7(~{1Q})
NetR14_1: R14.1 R27.2 U6.6(1Q)
NetR15_2: R15.2 U6.1(~{1RD}) U7.1(OUTA) U7.6(OUTB)
NetR18_2: R18.2 U6.11(~{2SD}) U6.13(~{2K}) U6.14(2J) U6.15(~{2RD})
NetU4_4: U4.4(Y) U5.2(A)
NetU5_4: U5.4(Y) U6.4(1CP)

Not connected (* = marked no-connect by the designer): U6 9(~{2Q}) 10(2Q)

### Channels
U_OZ440-SE140-CAR001_sheet4_Engagement_block: designators end in _U_OZ440-SE140-CAR001_sheet4_Engagement_block#1; ports DISABLE_OUTPUT=POWER2_EN_DELAYED INA+=SENSOR_P INA-=SENSOR_N LATCHED_OUTPUT=NetQ2_U_OZ440-SE140-CAR001_sheet4_Engagement_block#1_3 Local_GND=GND Local_VCC=3V3_CH1
U_OZ440-SE140-CAR001_sheet4_Engagement_block: designators end in _U_OZ440-SE140-CAR001_sheet4_Engagement_block#2; ports DISABLE_OUTPUT=POWER1_EN_DELAYED INA+=SENSOR_P INA-=SENSOR_N LATCHED_OUTPUT=NetQ2_U_OZ440-SE140-CAR001_sheet4_Engagement_block#2_3 Local_GND=GND Local_VCC=VCC

### Notes on the sheet
- Titre document:
- NAIO TECHNOLOGIES
- 3 Av didier Daurat
- 31400 TOULOUSE
- Auteur:
- Numéro document:
- Verificateur:
- Format:
- A3
- Date:
- Revision:
- Page:
- /

### Library data of the parts
C10 C11 C13 C14 C18 = VJ0805Y104KXAxx: as C1 on sheet OZ440-SE140-CAR001_sheet2_power_supply; Reference: VJ0805Y104KXAxx; Value: 100nF; Material: X7R; Footprint description: standard Capacitor 0805; Pin Count: 2; helpURL: http://www.vishay.com/docs/45200/highrels.pdf; Supplier 1: Farnell; Supplier Part Number 1: 1612208; Supplier 2: Digi-Key; Supplier Part Number 2: 720-1266-6-ND
C12 = C0805C106K9PACxx: as C4 on sheet OZ440-SE140-CAR001_sheet2_power_supply; Reference: C0805C106K9PACxx; Value: 10uF; Material: X5R; Footprint description: standard Capacitor 0805; Pin Count: 2; helpURL: http://www.farnell.com/datasheets/40863.pdf; Supplier 1: Farnell; Supplier Part Number 1: 1643357; Supplier 2: Digi-Key; Supplier Part Number 2: 399-3138-1-ND
D1 = BAS16: 100V / 120mA signal  diode; Manufacturer: NXP; Max Voltage: 100; Max Current: 0.2A; Validated: False; Reference: BAS16; component type: DIODE; Footprint description: Sot23 SMD package; Pin Count: 3; Rev: 2010; helpURL: http://www.nxp.com/documents/data_sheet/BAS16_SER.pdf; Supplier 1: Farnell; Supplier Part Number 1: 1081180; Supplier 2: Digi-Key; Supplier Part Number 2: 568-1596-1-ND
D2 = MC20449: LED 3mm red TH; Manufacturer: MULTICOMP; Max Current: 20mA; Validated: False; Reference: MC20449; Footprint description: TH 2.54mm pitch; Pin Count: 2; Rev: A; helpURL: http://www.newark.com/pdfs/datasheets/spc/87K7075.pdf; Supplier 1: Farnell; Supplier Part Number 1: 1249909
Q2 = 2N7002: N-Channel Enhancement Mode Field Effect Transistor; Manufacturer: FAIRCHILD; Max Voltage: 60 V; Max Current: 0,4 A; Rated Power: 0,2 W; Validated: False; Reference: 2N7002; component type: NMOS; Footprint description: SOT23; Pin Count: 3; Rev: A1; helpURL: http://www.fairchildsemi.com/ds/2N/2N7000.pdf; Supplier 1: Farnell; Supplier Part Number 1: 9845313; Supplier 2: Newark; Supplier Part Number 2: 58K9651
R11 R14-R18 = CRCW080510K0FKxx: as R2 on sheet OZ440-SE140-CAR001_sheet2_power_supply; Reference: CRCW080510K0FKxx; Footprint description: standard 0805 SMD; Pin Count: 2; helpURL: http://www.vishay.com/docs/20035/dcrcwe3.pdf; Supplier 1: Farnell; Supplier Part Number 1: 1469856; Supplier 2: Mouser; Supplier Part Number 2: 71-CRCW0805-10K-E3
R12 = CRCW0805100KFKxx: 100k Ohm 0805 SMD resistor; Manufacturer: Vishay; Value: 100 000; Tolerance: 1 %; Rated Power: 0,125 W; Validated: No; Reference: CRCW0805100KFKxx; Footprint description: standard 0805 SMD; Pin Count: 2; helpURL: http://www.vishay.com/docs/20035/dcrcwe3.pdf; Supplier 1: Farnell; Supplier Part Number 1: 1469860; Supplier 2: Mouser; Supplier Part Number 2: 71-CRCW0805-100K-E3
R13 = CRCW0805300RFKxx: as R26 on sheet OZ440-SE140-CAR001_sheet1; Reference: CRCW0805300RFKxx; Footprint description: standard 0805 SMD; Pin Count: 2; helpURL: http://www.vishay.com/docs/20035/dcrcwe3.pdf; Supplier 1: Mouser; Supplier Part Number 1: 71-CRCW0805300RFKEA; Supplier 2: Farnell; Supplier Part Number 2: 1152346
R27 = CRCW08051K00FKxx: as R7 on sheet OZ440-SE140-CAR001_sheet3_Power_Switch; Reference: CRCW08051K00FKxx; Footprint description: standard 0805 SMD; Pin Count: 2; helpURL: http://www.vishay.com/docs/20035/dcrcwe3.pdf; Supplier 1: Farnell; Supplier Part Number 1: 1469847; Supplier 2: Mouser; Supplier Part Number 2: 71-CRCW0805-1.0K-E3
U4 U5 = 74LVC1G14GW: smith trigger inverter; Manufacturer: NXP; Max Voltage: 5,5V; Validated: False; Reference: 74LVC1G14GW; Footprint description: SOT353-1, 5 pin; Pin Count: 5; helpURL: http://www.nxp.com/documents/data_sheet/74LVC1G14.pdf; Supplier 1: Farnell; Supplier Part Number 1: 1631687; Supplier 2: Digi-Key; Supplier Part Number 2: 568-2267-1-ND
U6 = 74HC109DB: Dual JK flip-flop with set and reset; Manufacturer: NXP; Max Voltage: 6V; Validated: False; Reference: 74HC109DB; Footprint description: TSSOP16 SMT package; Pin Count: 16; helpURL: http://www.nxp.com/documents/data_sheet/74HC_HCT109_CNV.pdf; Supplier 1: Mouser; Supplier Part Number 1: 771-HC109DB112; Supplier 2: Digi-Key; Supplier Part Number 2: 74HC109DB,118-ND
U7 = TPS3700DD: Window Comparator for Over- and Undervoltage Detection; Manufacturer: TI; Max Voltage: 18; Validated: False; Reference: TPS3700DD; Footprint description: SOT23 - 6pin; Pin Count: 6; Rev: 05/2013; helpURL: http://www.ti.com/lit/ds/symlink/tps3700.pdf; Supplier 1: Farnell; Supplier Part Number 1: 2345931; Supplier 2: Mouser; Supplier Part Number 2: 595-TPS3700DDCR

## Sheet OZ440-SE140-CAR001_sheet5_enable_delay.SchDoc
size A3
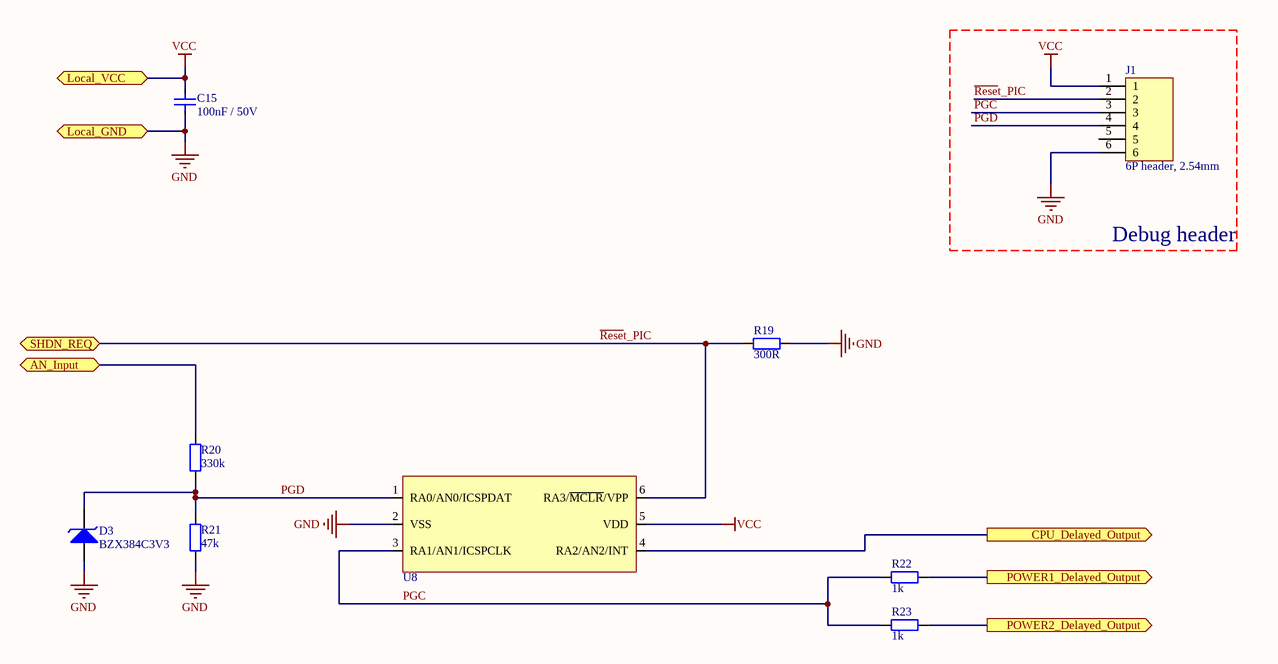
[diagram p4: OZ440-SE140-CAR001_sheet5_enable_delay.SchDoc]

### Parts
C15  Displayed reference: 100nF / 50V  [C0805-STD]  (hidden comment: CAP-SMD)
D3  Displayed reference: BZX384C3V3  [SOD323-SPE-BZX384]  (hidden comment: DIODE_ZENER-SOD323)
J1  Displayed reference: 6P header, 2.54mm  [6P_HEADER-STD_TH_1ROW]  (hidden comment: CONN-STD-6P_1ROW)
R19  Displayed reference: 300R  [R0805-STD]  (hidden comment: RES-SMD)
R20  Displayed reference: 330k  [R0805-STD]  (hidden comment: RES-SMD)
R21  Displayed reference: 47k  [R0805-STD]  (hidden comment: RES-SMD)
R22  Displayed reference: 1k  [R0805-STD]  (hidden comment: RES-SMD)
R23  Displayed reference: 1k  [R0805-STD]  (hidden comment: RES-SMD)
U8  PIC10F320-SOT23_6  [SOT23_6-SPE-PIC10F320]  (value not drawn)

### Ports
AN_Input, CPU_Delayed_Output (out), Local_GND, Local_VCC, POWER1_Delayed_Output (out), POWER2_Delayed_Output (out), SHDN_REQ

### Nets
GND: C15.2 D3.A J1.6 R19.2 R21.2 U8.2(VSS) ; port Local_GND
VCC: C15.1 J1.1 U8.5(VDD) ; port Local_VCC  [project net PIC_PWR]
~{Rese}t_PIC: J1.2 R19.1 U8.6(RA3/~{MCLR}/VPP) ; port SHDN_REQ
MAIN_POWER_SWITCHED: R20.2 ; port AN_Input
PGC: J1.3 R22.1 R23.1 U8.3(RA1/AN1/ICSPCLK)
PGD: D3.K J1.4 R20.1 R21.1 U8.1(RA0/AN0/ICSPDAT)
POWER1_EN_DELAYED: R22.2 ; port POWER1_Delayed_Output
POWER2_EN_DELAYED: R23.2 ; port POWER2_Delayed_Output
NetU3_U_OZ440-SE140-CAR001_sheet3_Power_Switch#3_5: U8.4(RA2/AN2/INT) ; port CPU_Delayed_Output

Not connected (* = marked no-connect by the designer): J1 5

### Notes on the sheet
- Debug header
- Titre document:
- NAIO TECHNOLOGIES
- 3 Av didier Daurat
- 31400 TOULOUSE
- Auteur:
- Numéro document:
- Verificateur:
- Format:
- A3
- Date:
- Revision:
- Page:
- /

### Library data of the parts
C15 = VJ0805Y104KXAxx: as C1 on sheet OZ440-SE140-CAR001_sheet2_power_supply; Reference: VJ0805Y104KXAxx; Value: 100nF; Material: X7R; Footprint description: standard Capacitor 0805; Pin Count: 2; helpURL: http://www.vishay.com/docs/45200/highrels.pdf; Supplier 1: Farnell; Supplier Part Number 1: 1612208; Supplier 2: Digi-Key; Supplier Part Number 2: 720-1266-6-ND
D3 = BZX384C3V3: 3.3V zener diode; Manufacturer: VISHAY; Rated Power: 200mW; Validated: False; Reference: BZX384C3V3; component type: Zener diode; Value: 3.3V; Footprint description: SOD323; Pin Count: 2; Rev: 1.9; helpURL: http://www.vishay.com/docs/85764/bzx384.pdf; Supplier 1: Mouser; Supplier Part Number 1: 78-BZX384C3V3-E3-08; Supplier 2: Farnell; Supplier Part Number 2: 8735646
J1 = 68000-406HLF: 6P, 1 row, 2.54mm header; Manufacturer: FCI; Validated: False; Reference: 68000-406HLF; Footprint description: TH, 6 pin, 2.54mm; Pin Count: 6; Rev: DB; helpURL: http://portal.fciconnect.com/Comergent//fci/drawing/68000.pdf
R19 = CRCW0805300RFKxx: as R26 on sheet OZ440-SE140-CAR001_sheet1; Reference: CRCW0805300RFKxx; Footprint description: standard 0805 SMD; Pin Count: 2; helpURL: http://www.vishay.com/docs/20035/dcrcwe3.pdf; Supplier 1: Mouser; Supplier Part Number 1: 71-CRCW0805300RFKEA; Supplier 2: Farnell; Supplier Part Number 2: 1152346
R20 = CRCW0805330KFKxx: as R3 on sheet OZ440-SE140-CAR001_sheet2_power_supply; Reference: CRCW0805330KFKxx; Footprint description: standard 0805 SMD; Pin Count: 2; helpURL: http://www.vishay.com/docs/20035/dcrcwe3.pdf; Supplier 1: Farnell; Supplier Part Number 1: 2123444; Supplier 2: Mouser; Supplier Part Number 2: 71-CRCW0805330KFKEA
R21 = CRCW080547K0FKxx: 47k Ohm 0805 SMD resistor; Manufacturer: Vishay; Value: 47 000; Tolerance: 1 %; Rated Power: 0,125 W; Validated: No; Reference: CRCW080547K0FKxx; Footprint description: standard 0805 SMD; Pin Count: 2; helpURL: http://www.vishay.com/docs/20035/dcrcwe3.pdf; Supplier 1: Farnell; Supplier Part Number 1: 1469929; Supplier 2: Mouser; Supplier Part Number 2: 71-CRCW0805-47K-E3
R22 R23 = CRCW08051K00FKxx: as R7 on sheet OZ440-SE140-CAR001_sheet3_Power_Switch; Reference: CRCW08051K00FKxx; Footprint description: standard 0805 SMD; Pin Count: 2; helpURL: http://www.vishay.com/docs/20035/dcrcwe3.pdf; Supplier 1: Farnell; Supplier Part Number 1: 1469847; Supplier 2: Mouser; Supplier Part Number 2: 71-CRCW0805-1.0K-E3
U8 = PIC10F320T-I/OT: 6 pin Low cost microcontroller; Manufacturer: MICROCHIP; Validated: False; Reference: PIC10F320T-I/OT; Displayed reference: PIC10F320; Footprint description: SOT23 6 pin; Pin Count: 6; Rev: B; helpURL: http://ww1.microchip.com/downloads/en/DeviceDoc/40001585B.pdf; Supplier 1: Farnell; Supplier Part Number 1: 2315759; Supplier 2: Mouser; Supplier Part Number 2: 579-PIC10F320T-I/OT

## Sheet OZ440-SE140-CAR001_sheet6_Sensor_Connector.SchDoc
size A3
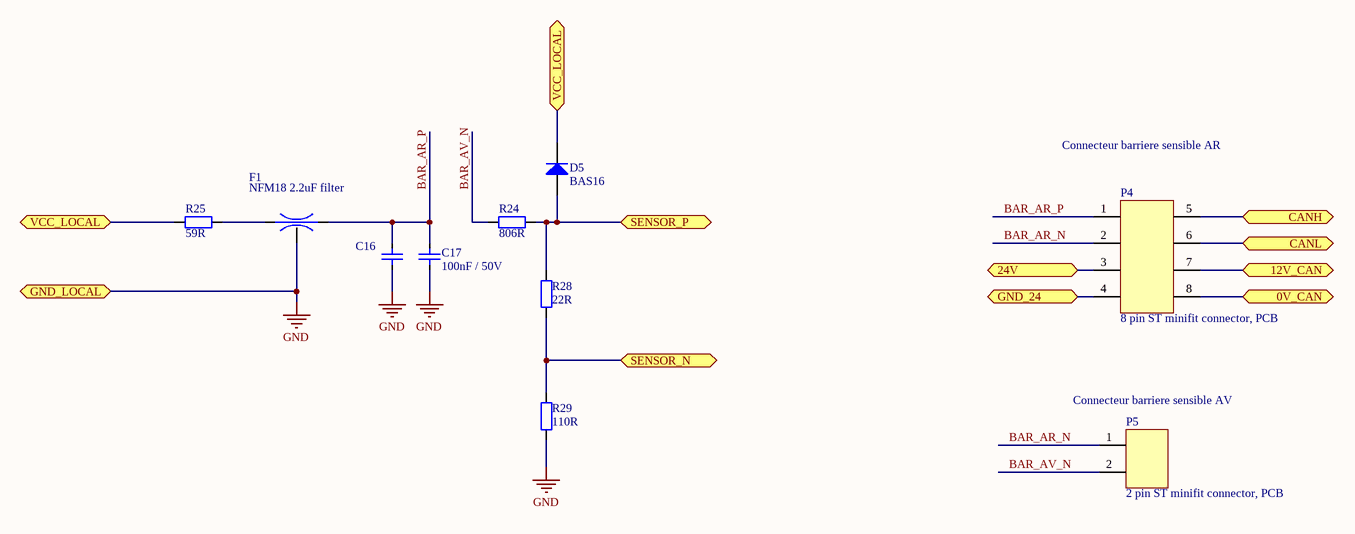
[diagram p5: OZ440-SE140-CAR001_sheet6_Sensor_Connector.SchDoc]

### Parts
(Parts that share a designator on the sheet are numbered #1, #2 ... from top to bottom, then left to right.)
C16  CAP-SMD  [C0805-STD]  (value not drawn)
C17  Displayed reference: 100nF / 50V  [C0805-STD]  (hidden comment: CAP-SMD)
D5  Displayed reference: BAS16  [SOT23-STD]  (hidden comment: BAS16-SOT23)
F1#2  Displayed reference: NFM18 2.2uF filter  [LC_0603-STD]  (hidden comment: LC_FILTER-STD)
P4  Displayed reference: 8 pin ST minifit connector, PCB  [CONN-SPE_MOLEX_39-28-1083]  (hidden comment: CONN-SPE-8P_MOLEX_39-28-1083)
P5  Displayed reference: 2 pin ST minifit connector, PCB  [CONN-SPE_MOLEX_39-28-1023]  (hidden comment: CONN-SPE-8P_MOLEX_39-28-1023)
R24  Displayed reference: 806R  [R0805-STD]  (hidden comment: RES-SMD)
R25  Displayed reference: 59R  [R0805-STD]  (hidden comment: RES-SMD)
R28  Displayed reference: 22R  [R0805-STD]  (hidden comment: RES-SMD)
R29  Displayed reference: 110R  [R0805-STD]  (hidden comment: RES-SMD)

### Ports
0V_CAN, 12V_CAN, 24V, CANH, CANL, GND_24, GND_LOCAL, SENSOR_N, SENSOR_P, VCC_LOCAL

### Nets
3V3_CH1: D5.3(K) R25.1 ; port VCC_LOCAL
GND: C16.1 C17.2 F1#2.3(G) P4.4 R29.1 ; port GND_LOCAL, port GND_24
0V_CAN: P4.8 ; port 0V_CAN
12V_CAN: P4.7 ; port 12V_CAN
BAR_AR_N: P4.2 P5.1
BAR_AR_P: C16.2 C17.1 F1#2.2(B) P4.1
BAR_AV_N: P5.2 R24.2
CANH: P4.5 ; port CANH
CANL: P4.6 ; port CANL
SENSOR_N: R28.1 R29.2 ; port SENSOR_N
SENSOR_P: D5.1(A) R24.1 R28.2 ; port SENSOR_P
NetF1#2_1: F1#2.1(A) R25.2
NetF2_2: P4.3 ; port 24V

### Notes on the sheet
- Connecteur barriere sensible AR
- (near P5) Connecteur barriere sensible AV
- Titre document:
- NAIO TECHNOLOGIES
- 3 Av didier Daurat
- 31400 TOULOUSE
- Auteur:
- Numéro document:
- Verificateur:
- Format:
- A3
- Date:
- Revision:
- Page:
- /

### Library data of the parts
C16 C17 = VJ0805Y104KXAxx: as C1 on sheet OZ440-SE140-CAR001_sheet2_power_supply; Reference: VJ0805Y104KXAxx; Value: 100nF; Material: X7R; Footprint description: standard Capacitor 0805; Pin Count: 2; helpURL: http://www.vishay.com/docs/45200/highrels.pdf; Supplier 1: Farnell; Supplier Part Number 1: 1612208; Supplier 2: Digi-Key; Supplier Part Number 2: 720-1266-6-ND
  C16: Displayed reference: 100nF / 50V
D5 = BAS16: as D1 on sheet OZ440-SE140-CAR001_sheet4_Engagement_block; Reference: BAS16; component type: DIODE; Footprint description: Sot23 SMD package; Pin Count: 3; Rev: 2010; helpURL: http://www.nxp.com/documents/data_sheet/BAS16_SER.pdf; Supplier 1: Farnell; Supplier Part Number 1: 1081180; Supplier 2: Digi-Key; Supplier Part Number 2: 568-1596-1-ND
F1#2 = NFM18PC225B0J3: 2A LC filter; Manufacturer: MURATA; Max Voltage: 6.3; Frequency band: 0-20Mhz; Validated: False; Reference: NFM18PC225B0J3; Max Current: 2A; Footprint description: standard 0603 filter package; Pin Count: 3; Rev: 2/11/2011; helpURL: http://www.murata.com/products/emc/application/pdf/EMIAPDCE_2.pdf; Supplier 1: Digi-Key; Supplier Part Number 1: NFM18PC225B0J3D-ND; Supplier 2: Mouser; Supplier Part Number 2: 81-NFM18PC225B0J3D
P4 = 39-28-1083: 8 pin Minifit connector; Manufacturer: Molex; Max Voltage: 600V; Max Current: 9A; Validated: False; Reference: 39-28-1083; Footprint description: 8 pin connector ST, TH; Pin Count: 8; Rev: L7; helpURL: http://www.molex.com/pdm_docs/sd/039281083_sd.pdf; Supplier 1: Mouser; Supplier Part Number 1: 538-39-28-1083; Supplier 2: Farnell; Supplier Part Number 2: 9732110
P5 = 39-28-1023: 2 pin Minifit connector; Manufacturer: Molex; Max Voltage: 600V; Max Current: 9A; Validated: False; Reference: 39-28-1023; Footprint description: 2 pin connector ST, TH; Pin Count: 2; Rev: L7; helpURL: http://www.molex.com/pdm_docs/sd/039281083_sd.pdf; Supplier 1: Mouser; Supplier Part Number 1: 538-39-28-1023; Supplier 2: Farnell; Supplier Part Number 2: 9732080
R24 = CRCW0805866KFKxx: 866k Ohm 0805 SMD resistor; Manufacturer: Vishay; Reference: CRCW0805806RFKxx; Value: 806; Tolerance: 1%; Rated Power: 0.125W; Validated: False; Footprint description: standard 0805 SMD; Pin Count: 2; helpURL: http://www.vishay.com/docs/20035/dcrcwe3.pdf
R25 = CRCW080559R0FKxx: 59 Ohm 0805 SMD resistor; Manufacturer: Vishay; Value: 59; Tolerance: 1 %; Rated Power: 0.125 W; Validated: No; Reference: CRCW080559R0FKxx; Footprint description: standard 0805 SMD; Pin Count: 2; helpURL: http://www.vishay.com/docs/20035/dcrcwe3.pdf; Supplier 1: Mouser; Supplier Part Number 1: 71-CRCW080559R0FKEA; Supplier 2: Farnell; Supplier Part Number 2: 2138817
R28 = CRCW080522R0FKxx: 22 Ohm 0805 SMD resistor; Manufacturer: Vishay; Value: 22; Tolerance: 1 %; Rated Power: 0.125 W; Validated: No; Reference: CRCW080522R0FKxx; Footprint description: standard 0805 SMD; Pin Count: 2; helpURL: http://www.vishay.com/docs/20035/dcrcwe3.pdf; Supplier 1: Farnell; Supplier Part Number 1: 1652962; Supplier 2: Mouser; Supplier Part Number 2: 71-CRCW0805-22-E3
R29 = CRCW080522R0FKxx: 22 Ohm 0805 SMD resistor; Manufacturer: Vishay; Reference: CRCW0805110RFKxx; Value: 110; Tolerance: 1 %; Rated Power: 0.125 W; Validated: No; Footprint description: standard 0805 SMD; Pin Count: 2; helpURL: http://www.vishay.com/docs/20035/dcrcwe3.pdf